# Altium schematic sheet 6_power_dcdc.SchDoc: Power management
size A4; OrganizationName: Pluton UPV; Address1: Universitat Politècnica; Address2: de València (UPV); Address3: Camí de Vera, València; Address4: Spain; SheetNumber: 11; SheetTotal: 12
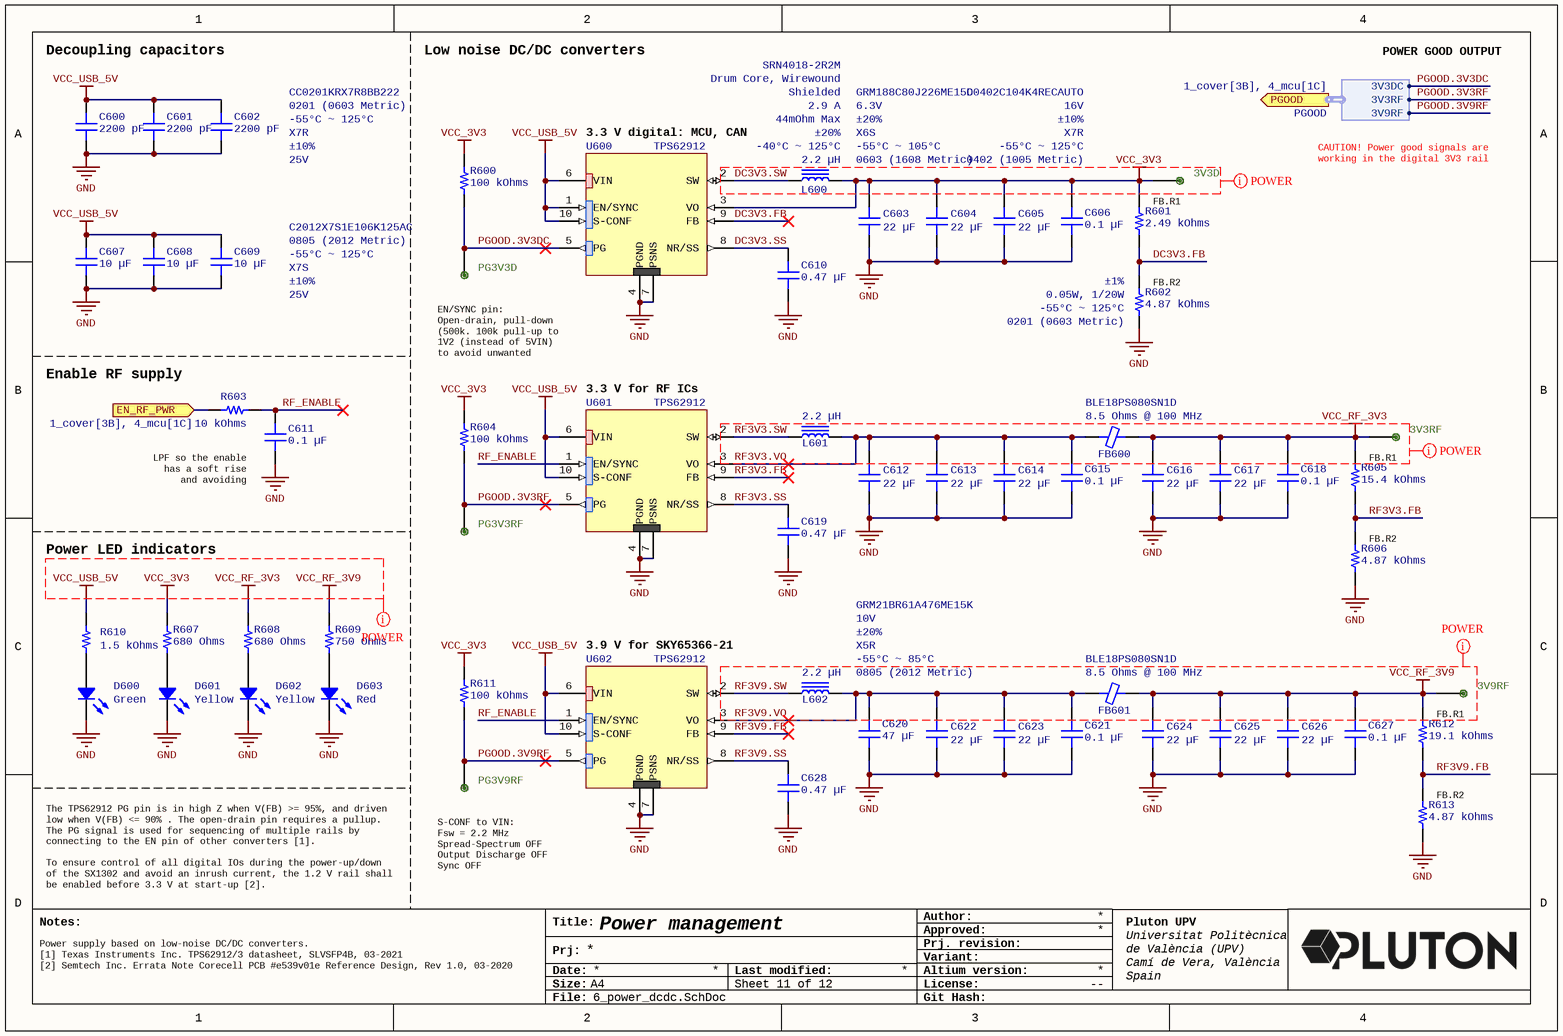
[diagram p0: 6_power_dcdc.SchDoc]

## Parts
3V3D  (no value)  [testpoint_via]  (no BOM)
3V3RF  (no value)  [testpoint_via]  (no BOM)
3V9RF  (no value)  [testpoint_via]  (no BOM)
C600  2200 pF  [CAP 0201_0603]
C601  2200 pF  [CAP 0201_0603]
C602  Part Number: CC0201KRX7R8BB222  Device Package: 0201 (0603 Metric)  Operating Temperature: -55°C ~ 125°C  Temperature Coefficient: X7R  Tolerance: ±10%  Voltage - Rated: 25V  [CAP 0201_0603]  (hidden comment: 2200 pF)
C603  Part Number: GRM188C80J226ME15D  Device Package: 0603 (1608 Metric)  Operating Temperature: -55°C ~ 105°C  Temperature Coefficient: X6S  Tolerance: ±20%  Voltage - Rated: 6.3V  [CAP 0603_1608]  (hidden comment: 22 µF)
C604  22 µF  [CAP 0603_1608]
C605  22 µF  [CAP 0603_1608]
C606  Part Number: C0402C104K4RECAUTO  Operating Temperature: -55°C ~ 125°C  Package / Case: 0402 (1005 Metric)  Temperature Coefficient: X7R  Tolerance: ±10%  Voltage - Rated: 16V  [CAP 0402_1005]  (hidden comment: 0.1 µF)
C607  10 µF  [CAP 0805_2012]
C608  10 µF  [CAP 0805_2012]
C609  Part Number: C2012X7S1E106K125AC  Device Package: 0805 (2012 Metric)  Operating Temperature: -55°C ~ 125°C  Temperature Coefficient: X7S  Tolerance: ±10%  Voltage - Rated: 25V  [CAP 0805_2012]  (hidden comment: 10 µF)
C610  0.47 µF  [CAP 0402_1005]
C611  0.1 µF  [CAP 0402_1005]
C612  22 µF  [CAP 0603_1608]
C613  22 µF  [CAP 0603_1608]
C614  22 µF  [CAP 0603_1608]
C615  0.1 µF  [CAP 0402_1005]
C616  22 µF  [CAP 0603_1608]
C617  22 µF  [CAP 0603_1608]
C618  0.1 µF  [CAP 0402_1005]
C619  0.47 µF  [CAP 0402_1005]
C620  Part Number: GRM21BR61A476ME15K  Device Package: 0805 (2012 Metric)  Operating Temperature: -55°C ~ 85°C  Temperature Coefficient: X5R  Tolerance: ±20%  Voltage - Rated: 10V  [CAP 0805_2012]  (hidden comment: 47 µF)
C621  0.1 µF  [CAP 0402_1005]
C622  22 µF  [CAP 0603_1608]
C623  22 µF  [CAP 0603_1608]
C624  22 µF  [CAP 0603_1608]
C625  22 µF  [CAP 0603_1608]
C626  22 µF  [CAP 0603_1608]
C627  0.1 µF  [CAP 0402_1005]
C628  0.47 µF  [CAP 0402_1005]
D600  Green  [LED 0402_1005 GREEN]
D601  Yellow  [LED 0402_1005 YELLOW]
D602  Yellow  [LED 0402_1005 YELLOW]
D603  Red  [LED 0402_1005 RED]
FB600  Part Number: BLE18PS080SN1D  [FER 0603_1608]  (hidden comment: 8.5 Ohms @ 100 MHz)
FB601  Part Number: BLE18PS080SN1D  [FER 0603_1608]  (hidden comment: 8.5 Ohms @ 100 MHz)
L600  2.2 µH  Part Number: SRN4018-2R2M  Current Rating (Amps): 2.9 A  DC Resistance (DCR): 44mOhm Max  Operating Temperature: -40°C ~ 125°C  Shielding: Shielded  Tolerance: ±20%  Type: Drum Core, Wirewound  [BOURNS SRN4018]
L601  2.2 µH  [BOURNS SRN4018]
L602  2.2 µH  [BOURNS SRN4018]
PG3V3D  (no value)  [testpoint_via]  (no BOM)
PG3V3RF  (no value)  [testpoint_via]  (no BOM)
PG3V9RF  (no value)  [testpoint_via]  (no BOM)
R600  100 kOhms  [RES 0201_0603]
R601  2.49 kOhms  [RES 0201_0603]
R602  Device Package: 0201 (0603 Metric)  Operating Temperature: -55°C ~ 125°C  Power (Watts): 0.05W, 1/20W  Tolerance: ±1%  [RES 0201_0603]  (hidden comment: 4.87 kOhms)
R603  10 kOhms  [RES 0201_0603]
R604  100 kOhms  [RES 0201_0603]
R605  15.4 kOhms  [RES 0201_0603]
R606  4.87 kOhms  [RES 0201_0603]
R607  680 Ohms  [RES 0201_0603]
R608  680 Ohms  [RES 0201_0603]
R609  750 Ohms  [RES 0201_0603]
R610  1.5 kOhms  [RES 0201_0603]
R611  100 kOhms  [RES 0201_0603]
R612  19.1 kOhms  [RES 0201_0603]
R613  4.87 kOhms  [RES 0201_0603]
U600  TPS62912  [VQFN-HR-TPS6291X]
U601  TPS62912  [VQFN-HR-TPS6291X]
U602  TPS62912  [VQFN-HR-TPS6291X]

## Ports
EN_RF_PWR (in, see 1_cover[3B], 4_mcu[1C]), PGOOD (out, harness PGOOD, see 1_cover[3B], 4_mcu[1C])

## Harnesses
PGOOD: 3V3DC, 3V3RF, 3V9RF

## Nets
GND: C600.1 C601.1 C602.1 C603.1 C604.1 C605.1 C606.1 C607.1 C608.1 C609.1 C610.1 C611.1 C612.1 C613.1 C614.1 C615.1 C616.1 C617.1 C618.1 C619.1 C620.1 C621.1 C622.1 C623.1 C624.1 C625.1 C626.1 C627.1 C628.1 D600.2 D601.2 D602.2 D603.2 R602.1 R606.1 R613.1 U600.4(PGND) U600.7(PSNS) U601.4(PGND) U601.7(PSNS) U602.4(PGND) U602.7(PSNS)
VCC_3V3: 3V3D.0 C603.2 C604.2 C605.2 C606.2 L600.2 R600.2 R601.2 R604.2 R607.2 R611.2 U600.3(VO)
VCC_RF_3V3: 3V3RF.0 C616.2 C617.2 C618.2 FB600.2 R605.2 R608.2
VCC_RF_3V9: 3V9RF.0 C624.2 C625.2 C626.2 C627.2 FB601.2 R609.2 R612.2
VCC_USB_5V: C600.2 C601.2 C602.2 C607.2 C608.2 C609.2 R610.2 U600.1(EN/SYNC) U600.6(VIN) U600.10(S-CONF) U601.6(VIN) U601.10(S-CONF) U602.6(VIN) U602.10(S-CONF)
DC3V3.FB: R601.1 R602.2 U600.9(FB)
DC3V3.SS: C610.2 U600.8(NR/SS)
DC3V3.SW: L600.1 U600.2(SW)
EN_RF_PWR: R603.2 ; port EN_RF_PWR
PGOOD.3V3DC: PG3V3D.0 R600.1 U600.5(PG) ; port PGOOD.3V3DC
PGOOD.3V3RF: PG3V3RF.0 R604.1 U601.5(PG) ; port PGOOD.3V3RF
PGOOD.3V9RF: PG3V9RF.0 R611.1 U602.5(PG) ; port PGOOD.3V9RF
RF3V3.FB: R605.1 R606.2 U601.9(FB)
RF3V3.SS: C619.2 U601.8(NR/SS)
RF3V3.SW: L601.1 U601.2(SW)
RF3V3.VO: C612.2 C613.2 C614.2 C615.2 FB600.1 L601.2 U601.3(VO)
RF3V9.FB: R612.1 R613.2 U602.9(FB)
RF3V9.SS: C628.2 U602.8(NR/SS)
RF3V9.SW: L602.1 U602.2(SW)
RF3V9.VO: C620.2 C621.2 C622.2 C623.2 FB601.1 L602.2 U602.3(VO)
RF_ENABLE: C611.2 R603.1 U601.1(EN/SYNC) U602.1(EN/SYNC)
NetD600_1: D600.1 R610.1
NetD601_1: D601.1 R607.1
NetD602_1: D602.1 R608.1
NetD603_1: D603.1 R609.1

## Layout directives
rule Width Constraint [Pref Width = 0.4mm    Min Width = 0.3mm    Max Width = 0.5mm]; net class POWER: DC3V3.SW, RF3V3.SW, RF3V3.VO, RF3V9.SW, RF3V9.VO, VCC_3V3, VCC_RF_3V3, VCC_RF_3V9, VCC_USB_5V

## Notes on the sheet
- Decoupling capacitors
- Low noise DC/DC converters
- POWER GOOD OUTPUT
- (near U600) 3.3 V digital: MCU, CAN
- CAUTION! Power good signals are working in the digital 3V3 rail
- FB.R1
- (near R602) FB.R2
- Enable RF supply
- EN/SYNC pin: Open-drain, pull-down (500k. 100k pull-up to 1V2 (instead of 5VIN) to avoid unwanted power-up
- (near U601) 3.3 V for RF ICs
- LPF so the enable
  has a soft rise
  and avoiding glitches
- Power LED indicators
- (near R606) FB.R2
- (near U602) 3.9 V for SKY65366-21
- The TPS62912 PG pin is in high Z when V(FB) >= 95%, and driven low when V(FB) <= 90% . The open-drain pin requires a pullup. The PG signal is used for sequencing of multiple rails by connecting to the EN pin of other converters [1].
- (near R613) FB.R2
- To ensure control of all digital IOs during the power-up/down of the SX1302 and avoid an inrush current, the 1.2 V rail shall be enabled before 3.3 V at start-up [2].
- S-CONF to VIN:
  Fsw = 2.2 MHz
  Spread-Spectrum OFF
  Output Discharge OFF
  Sync OFF
- Power supply based on low-noise DC/DC converters.
  [1] Texas Instruments Inc. TPS62912/3 datasheet, SLVSFP4B, 03-2021
  [2] Semtech Inc. Errata Note Corecell PCB #e539v01e Reference Design, Rev 1.0, 03-2020
- Notes:
- Title:
- Author:
- Approved:
- Date:
- Prj:
- Size:
- A4
- Last modified:
- Altium version:
- Variant:
- Prj. revision:
- License:
- --
- File:
- Git Hash:

## Library data of the parts
3V3D 3V3RF 3V9RF PG3V3D PG3V3RF PG3V9RF = TestPoint-VIA: Test point, thru-hole
C600 C601 = CC0201KRX7R8BB222: CAP CER 2200PF 25V X7R 0201; manufacturer: Yageo; Tolerance: ±10%; Part Number: CC0201KRX7R8BB222; Value: 2200 pF; Applications: General Purpose; Capacitance: 2200 pF; componentlink1description: Datasheet; componentlink1url: https://www.yageo.com/upload/media/product/productsearch/datasheet/mlcc/UPY-GPHC_X7R_6.3V-to-250V_22.pdf; componentlink2description: DigiKey Link; componentlink2url: https://www.digikey.com/en/products/detail/yageo/CC0201KRX7R8BB222/11490225; Device Package: 0201 (0603 Metric); lastupdated: 04/06/2024 19:00:56; Lifecycle Status: Active; Minimum Order: 1; Mounting Type: Surface Mount, MLCC; Operating Temperature: -55°C ~ 125°C; Package / Case: 0201 (0603 Metric); packaging: CutTape; partid: 52408; Part Status: Active; price: 0.01; series: CC; Size / Dimension: 0.024" L x 0.012" W (0.60mm x 0.30mm); Supplier 1: DigiKey; Supplier Part Number 1: 13-CC0201KRX7R8BB222CT-ND; Temperature Coefficient: X7R; Thickness (Max): 0.013" (0.33mm); Voltage - Rated: 25V
C602 = CC0201KRX7R8BB222: CAP CER 2200PF 25V X7R 0201; manufacturer: Yageo; Value: 2200 pF; Applications: General Purpose; Capacitance: 2200 pF; componentlink1description: Datasheet; componentlink1url: https://www.yageo.com/upload/media/product/productsearch/datasheet/mlcc/UPY-GPHC_X7R_6.3V-to-250V_22.pdf; componentlink2description: DigiKey Link; componentlink2url: https://www.digikey.com/en/products/detail/yageo/CC0201KRX7R8BB222/11490225; lastupdated: 04/06/2024 19:00:56; Lifecycle Status: Active; Minimum Order: 1; Mounting Type: Surface Mount, MLCC; Package / Case: 0201 (0603 Metric); packaging: CutTape; partid: 52408; Part Status: Active; price: 0.01; series: CC; Size / Dimension: 0.024" L x 0.012" W (0.60mm x 0.30mm); Supplier 1: DigiKey; Supplier Part Number 1: 13-CC0201KRX7R8BB222CT-ND; Thickness (Max): 0.013" (0.33mm)
C603 = GRM188C80J226ME15D: CAP CER 22UF 6.3V X6S 0603; manufacturer: Murata Electronics; Value: 22 µF; Applications: General Purpose; Capacitance: 22 µF; componentlink1description: Datasheet; componentlink1url: https://search.murata.co.jp/Ceramy/image/img/A01X/G101/ENG/GRM188C80J226ME15-01.pdf; componentlink2description: DigiKey Link; componentlink2url: https://www.digikey.com/en/products/detail/murata-electronics/GRM188C80J226ME15D/5027556; lastupdated: 09/02/2024 20:10:26; Lifecycle Status: Active; Minimum Order: 1; Mounting Type: Surface Mount, MLCC; Package / Case: 0603 (1608 Metric); packaging: TapeAndReel; partid: 39580; Part Status: Active; price: 0.03; series: GRM; Size / Dimension: 0.063" L x 0.031" W (1.60mm x 0.80mm); Supplier 1: DigiKey; Supplier Part Number 1: 490-10471-1-ND; Thickness (Max): 0.039" (1.00mm)
C604 C605 C612-C614 C616 C617 C622-C626 = GRM188C80J226ME15D: CAP CER 22UF 6.3V X6S 0603; manufacturer: Murata Electronics; Tolerance: ±20%; Part Number: GRM188C80J226ME15D; Value: 22 µF; Applications: General Purpose; Capacitance: 22 µF; componentlink1description: Datasheet; componentlink1url: https://search.murata.co.jp/Ceramy/image/img/A01X/G101/ENG/GRM188C80J226ME15-01.pdf; componentlink2description: DigiKey Link; componentlink2url: https://www.digikey.com/en/products/detail/murata-electronics/GRM188C80J226ME15D/5027556; Device Package: 0603 (1608 Metric); lastupdated: 09/02/2024 20:10:26; Lifecycle Status: Active; Minimum Order: 1; Mounting Type: Surface Mount, MLCC; Operating Temperature: -55°C ~ 105°C; Package / Case: 0603 (1608 Metric); packaging: TapeAndReel; partid: 39580; Part Status: Active; price: 0.03; series: GRM; Size / Dimension: 0.063" L x 0.031" W (1.60mm x 0.80mm); Supplier 1: DigiKey; Supplier Part Number 1: 490-10471-1-ND; Temperature Coefficient: X6S; Thickness (Max): 0.039" (1.00mm); Voltage - Rated: 6.3V
C606 C611 C615 C618 C621 C627 = C0402C104K4RECAUTO: CAP CER 0402 0.1UF 16V X7R 10%; manufacturer: KEMET; Value: 0.1 µF; Applications: Automotive, ESD Protection; Capacitance: 0.1 µF; componentlink1description: Datasheet; componentlink1url: https://api.kemet.com/component-edge/download/datasheet/C0402C104K4RECAUTO.pdf; componentlink2description: DigiKey Link; componentlink2url: https://www.digikey.com/en/products/detail/kemet/C0402C104K4RECAUTO/8563695; Device Package: 0402 (1005 Metric); lastupdated: 09/02/2024 20:04:38; Lifecycle Status: Active; Minimum Order: 1; Mounting Type: Surface Mount, MLCC; packaging: TapeAndReel; partid: 1731; Part Status: Active; price: 0.01; Ratings: AEC-Q200; series: ESD SMD Auto X7R; Size / Dimension: 0.039" L x 0.020" W (1.00mm x 0.50mm); Supplier 1: DigiKey; Supplier Part Number 1: 399-17167-1-ND; Thickness (Max): 0.022" (0.55mm)
  C611 C615 C618 C621 C627: Part Number: C0402C104K4RECAUTO; Operating Temperature: -55°C ~ 125°C; Package / Case: 0402 (1005 Metric); Temperature Coefficient: X7R; Tolerance: ±10%; Voltage - Rated: 16V
C607 C608 = C2012X7S1E106K125AC: CAP CER 10UF 25V X7S 0805; manufacturer: TDK Corporation; Tolerance: ±10%; Part Number: C2012X7S1E106K125AC; Value: 10 µF; Applications: General Purpose; Capacitance: 10 µF; componentlink1description: Datasheet; componentlink1url: https://product.tdk.com/en/search/capacitor/ceramic/mlcc/info?part_no=C2012X7S1E106K125AC?ref_disty=digikey; componentlink2description: DigiKey Link; componentlink2url: https://www.digikey.com/en/products/detail/tdk-corporation/C2012X7S1E106K125AC/9991385; Device Package: 0805 (2012 Metric); Features: Low ESL; lastupdated: 09/02/2024 20:16:06; Lifecycle Status: Active; Minimum Order: 1; Mounting Type: Surface Mount, MLCC; Operating Temperature: -55°C ~ 125°C; Package / Case: 0805 (2012 Metric); packaging: TapeAndReel; partid: 39303; Part Status: Active; price: 0.11; series: C; Size / Dimension: 0.079" L x 0.049" W (2.00mm x 1.25mm); Supplier 1: DigiKey; Supplier Part Number 1: 445-181600-1-ND; Temperature Coefficient: X7S; Thickness (Max): 0.059" (1.50mm); Voltage - Rated: 25V
C609 = C2012X7S1E106K125AC: CAP CER 10UF 25V X7S 0805; manufacturer: TDK Corporation; Value: 10 µF; Applications: General Purpose; Capacitance: 10 µF; componentlink1description: Datasheet; componentlink1url: https://product.tdk.com/en/search/capacitor/ceramic/mlcc/info?part_no=C2012X7S1E106K125AC?ref_disty=digikey; componentlink2description: DigiKey Link; componentlink2url: https://www.digikey.com/en/products/detail/tdk-corporation/C2012X7S1E106K125AC/9991385; Features: Low ESL; lastupdated: 09/02/2024 20:16:06; Lifecycle Status: Active; Minimum Order: 1; Mounting Type: Surface Mount, MLCC; Package / Case: 0805 (2012 Metric); packaging: TapeAndReel; partid: 39303; Part Status: Active; price: 0.11; series: C; Size / Dimension: 0.079" L x 0.049" W (2.00mm x 1.25mm); Supplier 1: DigiKey; Supplier Part Number 1: 445-181600-1-ND; Thickness (Max): 0.059" (1.50mm)
C610 C619 C628 = CGA2B1X7S1C474K050BC: CAP CER 0.47UF 16V X7S 0402; manufacturer: TDK Corporation; Tolerance: ±10%; Part Number: CGA2B1X7S1C474K050BC; Value: 0.47 µF; Applications: Automotive; Capacitance: 0.47 µF; componentlink1description: Datasheet; componentlink1url: https://product.tdk.com/info/en/catalog/datasheets/mlcc_automotive_general_en.pdf?ref_disty=digikey; componentlink2description: DigiKey Link; componentlink2url: https://www.digikey.com/en/products/detail/tdk-corporation/CGA2B1X7S1C474K050BC/4931442; Device Package: 0402 (1005 Metric); lastupdated: 09/02/2024 20:04:28; Lifecycle Status: Active; Minimum Order: 1; Mounting Type: Surface Mount, MLCC; Operating Temperature: -55°C ~ 125°C; Package / Case: 0402 (1005 Metric); packaging: TapeAndReel; partid: 7602; Part Status: Active; price: 0.03; Ratings: AEC-Q200; series: CGA; Size / Dimension: 0.039" L x 0.020" W (1.00mm x 0.50mm); Supplier 1: DigiKey; Supplier Part Number 1: 445-174214-1-ND; Temperature Coefficient: X7S; Thickness (Max): 0.022" (0.55mm); Voltage - Rated: 16V
C620 = GRM21BR61A476ME15K: CAP CER 47UF 10V X5R 0805; manufacturer: Murata Electronics; Value: 47 µF; Applications: General Purpose; Capacitance: 47 µF; componentlink1description: Datasheet; componentlink1url: https://www.murata.com/-/media/webrenewal/support/library/catalog/products/capacitor/ceramiccapacitor/c02e.ashx?la=en-us&cvid=20210120024548000000; componentlink2description: DigiKey Link; componentlink2url: https://www.digikey.com/en/products/detail/murata-electronics/GRM21BR61A476ME15K/4905528; lastupdated: 09/02/2024 20:14:59; Lifecycle Status: Active; Minimum Order: 1; Mounting Type: Surface Mount, MLCC; Package / Case: 0805 (2012 Metric); packaging: TapeAndReel; partid: 44285; Part Status: Active; price: 0.13; series: GRM; Size / Dimension: 0.079" L x 0.049" W (2.00mm x 1.25mm); Supplier 1: DigiKey; Supplier Part Number 1: 490-GRM21BR61A476ME15KCT-ND; Thickness (Max): 0.057" (1.45mm)
D600 = EAST10052GA0: LED GREEN CLEAR 2SMD; Manufacturer: Everlight Electronics Co Ltd; Configuration: Standard; Current - Test: 5mA; Lens Color: Colorless; Lens Size: 1.00mm x 0.50mm; Lens Style: Rectangle with Flat Top; Viewing Angle: 120°; Voltage - Forward (Vf) (Typ): 2.95V; Wavelength - Peak: 518nm; Part Number: EAST10052GA0; Color: Green; ComponentLink1Description: Datasheet; ComponentLink1URL: https://everlightamericas.com/index.php?controller=attachment&id_attachment=3256; ComponentLink2Description: DigiKey Link; ComponentLink2URL: https://www.digikey.com/en/products/detail/everlight-electronics-co-ltd/EAST10052GA0/8510366; Device Package: 0402 (1005 Metric); Height (Max): 0.25mm; LastUpdated: 03/06/2024 19:58:14; Lens Transparency: Clear; Lifecycle Status: Active; Minimum Order: 1; Mounting Type: Surface Mount; Package / Case: 0402 (1005 Metric); Packaging: TapeAndReel; PartId: 696; Part Status: Active; Price: 0.09; Series: -; Size / Dimension: 1.00mm L x 0.50mm W; Supplier 1: DigiKey; Supplier Part Number 1: 1080-1557-1-ND; Supplier Device Package: 2-SMD; Value: Green
D601 D602 = FHY1105P-TR: LED YELLOW CLEAR 1005 SMD; Manufacturer: Stanley Electric Co; Configuration: Standard; Current - Test: 5mA; Lens Color: Colorless; Lens Size: 1.00mm x 0.50mm; Lens Style: Rectangle with Flat Top; Millicandela Rating: 32mcd; Voltage - Forward (Vf) (Typ): 1.9V; Wavelength - Dominant: 590nm; Wavelength - Peak: 594nm; Part Number: FHY1105P-TR; Color: Yellow; ComponentLink1Description: Datasheet; ComponentLink1URL: http://www.stanley-components.com/php/downloaddatafile.php?rp=0,FHY1105P-TR_e.pdf; ComponentLink2Description: DigiKey Link; ComponentLink2URL: https://www.digikey.com/en/products/detail/stanley-electric-co/FHY1105P-TR/6205303; Device Package: 0402 (1005 Metric); Height (Max): 0.25mm; LastUpdated: 03/06/2024 20:00:47; Lens Transparency: Clear; Lifecycle Status: Active; Minimum Order: 1; Mounting Type: Surface Mount; Package / Case: 0402 (1005 Metric); Packaging: TapeAndReel; PartId: 166; Part Status: Active; Price: 0.05; Series: -; Size / Dimension: 1.00mm L x 0.50mm W; Supplier 1: DigiKey; Supplier Part Number 1: 404-1209-1-ND; Supplier Device Package: 1005; Value: Yellow
D603 = EAST10053RA0: LED RED CLEAR 2SMD; Manufacturer: Everlight Electronics Co Ltd; Configuration: Standard; Current - Test: 5mA; Lens Color: Colorless; Lens Size: 1.00mm x 0.50mm; Lens Style: Rectangle with Flat Top; Viewing Angle: 120°; Voltage - Forward (Vf) (Typ): 2.05V; Wavelength - Peak: 639nm; Part Number: EAST10053RA0; Color: Red; ComponentLink1Description: Datasheet; ComponentLink1URL: https://everlightamericas.com/index.php?controller=attachment&id_attachment=3575; ComponentLink2Description: DigiKey Link; ComponentLink2URL: https://www.digikey.com/en/products/detail/everlight-electronics-co-ltd/EAST10053RA0/8510365; Device Package: 0402 (1005 Metric); Height (Max): 0.35mm; LastUpdated: 03/06/2024 19:59:17; Lens Transparency: Clear; Lifecycle Status: Active; Minimum Order: 1; Mounting Type: Surface Mount; Package / Case: 0402 (1005 Metric); Packaging: TapeAndReel; PartId: 508; Part Status: Active; Price: 0.05; Series: -; Size / Dimension: 1.00mm L x 0.50mm W; Supplier 1: DigiKey; Supplier Part Number 1: 1080-1556-1-ND; Supplier Device Package: 2-SMD; Value: Red
FB600 FB601 = BLE18PS080SN1D: FERRITE BEAD 8.5 OHM 0603 1LN; Manufacturer: Murata Electronics; Current Rating (Max): 8A; DC Resistance (DCR) (Max): 4mOhm; Filter Type: Power Line; Number of Lines: 1; ComponentLink1Description: Datasheet; ComponentLink1URL: https://www.murata.com/products/productdata/8800169525278/ENFA0080.pdf; ComponentLink2Description: DigiKey Link; ComponentLink2URL: https://www.digikey.com/en/products/detail/murata-electronics/BLE18PS080SN1D/13904803; Device Package: 0603 (1608 Metric); Height (Max): 0.030" (0.75mm); Impedance @ Frequency: 8.5 Ohms @ 100 MHz; LastUpdated: 03/06/2024 19:51:46; Lifecycle Status: Active; Minimum Order: 1; Mounting Type: Surface Mount; Operating Temperature: -55°C ~ 125°C; Package / Case: 0603 (1608 Metric); Packaging: TapeAndReel; PartId: 2651; Part Status: Active; Price: 0.08; Series: EMIFIL®, BLE18; Size / Dimension: 0.063" L x 0.031" W (1.60mm x 0.80mm); Supplier 1: DigiKey; Supplier Part Number 1: 490-BLE18PS080SN1DCT-ND; Value: 8.5 Ohms @ 100 MHz
L600 = SRN4018-2R2M: FIXED IND 2.2UH 2.9A 44 MOHM SMD; Manufacturer: Bourns Inc.; Current - Saturation: 3A; Frequency - Self Resonant: 60MHz; Inductance Frequency - Test: 100 kHz; Material - Core: Ferrite; Q @ Freq: 9 @ 7.96MHz; ComponentLink1Description: Datasheet; ComponentLink1URL: https://www.bourns.com/docs/Product-Datasheets/SRN4018.pdf; ComponentLink2Description: DigiKey Link; ComponentLink2URL: https://www.digikey.com/en/products/detail/bourns-inc/SRN4018-2R2M/3821619; Device Package: Nonstandard; Height - Seated (Max): 0.071" (1.80mm); Inductance: 2.2 µH; LastUpdated: 03/06/2024 20:24:37; Lifecycle Status: Active; Minimum Order: 1; Mounting Type: Surface Mount; Package / Case: Nonstandard; Packaging: TapeAndReel; PartId: 3660; Part Status: Active; Price: 0.17; Series: SRN4018; Size / Dimension: 0.157" L x 0.157" W (4.00mm x 4.00mm); Supplier 1: DigiKey; Supplier Part Number 1: SRN4018-2R2MCT-ND; Value: 2.2 µH
L601 L602 = SRN4018-2R2M: FIXED IND 2.2UH 2.9A 44 MOHM SMD; Manufacturer: Bourns Inc.; Current - Saturation: 3A; DC Resistance (DCR): 44mOhm Max; Frequency - Self Resonant: 60MHz; Inductance Frequency - Test: 100 kHz; Material - Core: Ferrite; Q @ Freq: 9 @ 7.96MHz; Shielding: Shielded; Tolerance: ±20%; Type: Drum Core, Wirewound; Part Number: SRN4018-2R2M; ComponentLink1Description: Datasheet; ComponentLink1URL: https://www.bourns.com/docs/Product-Datasheets/SRN4018.pdf; ComponentLink2Description: DigiKey Link; ComponentLink2URL: https://www.digikey.com/en/products/detail/bourns-inc/SRN4018-2R2M/3821619; Current Rating (Amps): 2.9 A; Device Package: Nonstandard; Height - Seated (Max): 0.071" (1.80mm); Inductance: 2.2 µH; LastUpdated: 03/06/2024 20:24:37; Lifecycle Status: Active; Minimum Order: 1; Mounting Type: Surface Mount; Operating Temperature: -40°C ~ 125°C; Package / Case: Nonstandard; Packaging: TapeAndReel; PartId: 3660; Part Status: Active; Price: 0.17; Series: SRN4018; Size / Dimension: 0.157" L x 0.157" W (4.00mm x 4.00mm); Supplier 1: DigiKey; Supplier Part Number 1: SRN4018-2R2MCT-ND; Value: 2.2 µH
R600 R604 R611 = RC0201FR-13100KL: RES 100K OHM 1% 1/20W 0201; Manufacturer: Yageo; Power (Watts): 0.05W, 1/20W; Temperature Coefficient: ±200ppm/°C; Part Number: RC0201FR-13100KL; Value: 100 kOhms; ComponentLink1Description: Datasheet; ComponentLink1URL: https://www.yageo.com/upload/media/product/productsearch/datasheet/rchip/PYu-RC_Group_51_RoHS_L_12.pdf; ComponentLink2Description: DigiKey Link; ComponentLink2URL: https://www.digikey.com/en/products/detail/yageo/RC0201FR-13100KL/17014509; Composition: Thick Film; Device Package: 0201 (0603 Metric); Features: Moisture Resistant; Height - Seated (Max): 0.010" (0.26mm); LastUpdated: 04/06/2024 19:11:47; Lifecycle Status: Active; Minimum Order: 1; Number of Terminations: 2; Operating Temperature: -55°C ~ 125°C; Package / Case: 0201 (0603 Metric); Packaging: CutTape; PartId: 80199; Price: 0.01; Resistance: 100 kOhms; Series: RC_L; Size / Dimension: 0.024" L x 0.012" W (0.60mm x 0.30mm); Supplier 1: DigiKey; Supplier Part Number 1: 13-RC0201FR-13100KLCT-ND; Supplier Device Package: 0201; Tolerance: ±1%
R601 = AC0201FR-072K49L: RES SMD 2.49K OHM 1% 1/20W 0201; Manufacturer: Yageo; Power (Watts): 0.05W, 1/20W; Temperature Coefficient: ±200ppm/°C; Part Number: AC0201FR-072K49L; Value: 2.49 kOhms; ComponentLink1Description: Datasheet; ComponentLink1URL: https://www.yageo.com/upload/media/product/productsearch/datasheet/rchip/PYu-AC_51_RoHS_L_7.pdf; ComponentLink2Description: DigiKey Link; ComponentLink2URL: https://www.digikey.com/en/products/detail/yageo/AC0201FR-072K49L/5894499; Composition: Thick Film; Device Package: 0201 (0603 Metric); Features: Automotive AEC-Q200, Moisture Resistant; Height - Seated (Max): 0.010" (0.26mm); LastUpdated: 04/06/2024 19:11:59; Lifecycle Status: Active; Minimum Order: 1; Number of Terminations: 2; Operating Temperature: -55°C ~ 155°C; Package / Case: 0201 (0603 Metric); Packaging: TapeAndReel; PartId: 986; Part Status: Active; Price: 0.01; Ratings: AEC-Q200; Resistance: 2.49 kOhms; Series: AC; Size / Dimension: 0.024" L x 0.012" W (0.60mm x 0.30mm); Supplier 1: DigiKey; Supplier Part Number 1: YAG5189CT-ND; Supplier Device Package: 0201; Tolerance: ±1%
R602 = RC0201FR-074K87L: RES 4.87K OHM 1% 1/20W 0201; Manufacturer: Yageo; Temperature Coefficient: ±200ppm/°C; Part Number: RC0201FR-074K87L; Value: 4.87 kOhms; ComponentLink1Description: Datasheet; ComponentLink1URL: https://www.yageo.com/upload/media/product/productsearch/datasheet/rchip/PYu-RC_Group_51_RoHS_L_10.pdf; ComponentLink2Description: DigiKey Link; ComponentLink2URL: https://www.digikey.com/en/products/detail/yageo/RC0201FR-074K87L/5280571; Composition: Thick Film; Features: Moisture Resistant; Height - Seated (Max): 0.010" (0.26mm); LastUpdated: 04/06/2024 19:11:58; Lifecycle Status: Active; Minimum Order: 1; Number of Terminations: 2; Package / Case: 0201 (0603 Metric); Packaging: TapeAndReel; PartId: 1350; Part Status: Active; Price: 0.01; Resistance: 4.87 kOhms; Series: RC_L; Size / Dimension: 0.024" L x 0.012" W (0.60mm x 0.30mm); Supplier 1: DigiKey; Supplier Part Number 1: YAG2711CT-ND; Supplier Device Package: 0201
R603 = AF0201FR-0710KL: RES SMD 10K OHM 1% 1/20W 0201; Manufacturer: Yageo; Power (Watts): 0.05W, 1/20W; Temperature Coefficient: ±200ppm/°C; Part Number: AF0201FR-0710KL; Value: 10 kOhms; ComponentLink1Description: Datasheet; ComponentLink1URL: https://www.yageo.com/upload/media/product/productsearch/datasheet/rchip/PYu-AF_51_RoHS_L_9.pdf; ComponentLink2Description: DigiKey Link; ComponentLink2URL: https://www.digikey.com/en/products/detail/yageo/AF0201FR-0710KL/5900138; Composition: Thick Film; Device Package: 0201 (0603 Metric); Features: Anti-Sulfur, Automotive AEC-Q200; Height - Seated (Max): 0.010" (0.26mm); LastUpdated: 04/06/2024 19:11:47; Lifecycle Status: Active; Minimum Order: 1; Number of Terminations: 2; Operating Temperature: -55°C ~ 125°C; Package / Case: 0201 (0603 Metric); Packaging: TapeAndReel; PartId: 78061; Part Status: Active; Price: 0.01; Ratings: AEC-Q200; Resistance: 10 kOhms; Series: AF; Size / Dimension: 0.024" L x 0.012" W (0.60mm x 0.30mm); Supplier 1: DigiKey; Supplier Part Number 1: 13-AF0201FR-0710KLCT-ND; Supplier Device Package: 0201; Tolerance: ±1%
R605 = RC0201FR-0715K4L: RES 15.4K OHM 1% 1/20W 0201; Manufacturer: Yageo; Power (Watts): 0.05W, 1/20W; Temperature Coefficient: ±200ppm/°C; Part Number: RC0201FR-0715K4L; Value: 15.4 kOhms; ComponentLink1Description: Datasheet; ComponentLink1URL: https://www.yageo.com/upload/media/product/productsearch/datasheet/rchip/PYu-RC_Group_51_RoHS_L_10.pdf; ComponentLink2Description: DigiKey Link; ComponentLink2URL: https://www.digikey.com/en/products/detail/yageo/RC0201FR-0715K4L/5280281; Composition: Thick Film; Device Package: 0201 (0603 Metric); Features: Moisture Resistant; Height - Seated (Max): 0.010" (0.26mm); LastUpdated: 04/06/2024 19:12:00; Lifecycle Status: Active; Minimum Order: 1; Number of Terminations: 2; Operating Temperature: -55°C ~ 125°C; Package / Case: 0201 (0603 Metric); Packaging: TapeAndReel; PartId: 714; Part Status: Active; Price: 0.01; Resistance: 15.4 kOhms; Series: RC_L; Size / Dimension: 0.024" L x 0.012" W (0.60mm x 0.30mm); Supplier 1: DigiKey; Supplier Part Number 1: YAG2421CT-ND; Supplier Device Package: 0201; Tolerance: ±1%
R606 R613 = RC0201FR-074K87L: RES 4.87K OHM 1% 1/20W 0201; Manufacturer: Yageo; Power (Watts): 0.05W, 1/20W; Temperature Coefficient: ±200ppm/°C; Part Number: RC0201FR-074K87L; Value: 4.87 kOhms; ComponentLink1Description: Datasheet; ComponentLink1URL: https://www.yageo.com/upload/media/product/productsearch/datasheet/rchip/PYu-RC_Group_51_RoHS_L_10.pdf; ComponentLink2Description: DigiKey Link; ComponentLink2URL: https://www.digikey.com/en/products/detail/yageo/RC0201FR-074K87L/5280571; Composition: Thick Film; Device Package: 0201 (0603 Metric); Features: Moisture Resistant; Height - Seated (Max): 0.010" (0.26mm); LastUpdated: 04/06/2024 19:11:58; Lifecycle Status: Active; Minimum Order: 1; Number of Terminations: 2; Operating Temperature: -55°C ~ 125°C; Package / Case: 0201 (0603 Metric); Packaging: TapeAndReel; PartId: 1350; Part Status: Active; Price: 0.01; Resistance: 4.87 kOhms; Series: RC_L; Size / Dimension: 0.024" L x 0.012" W (0.60mm x 0.30mm); Supplier 1: DigiKey; Supplier Part Number 1: YAG2711CT-ND; Supplier Device Package: 0201; Tolerance: ±1%
R607 R608 = RC0201JR-07680RL: RES 680 OHM 5% 1/20W 0201; Manufacturer: Yageo; Power (Watts): 0.05W, 1/20W; Temperature Coefficient: ±200ppm/°C; Part Number: RC0201JR-07680RL; Value: 680 Ohms; ComponentLink1Description: Datasheet; ComponentLink1URL: https://www.yageo.com/upload/media/product/productsearch/datasheet/rchip/PYu-RC_Group_51_RoHS_L_10.pdf; ComponentLink2Description: DigiKey Link; ComponentLink2URL: https://www.digikey.com/en/products/detail/yageo/RC0201JR-07680RL/1948962; Composition: Thick Film; Device Package: 0201 (0603 Metric); Features: Moisture Resistant; Height - Seated (Max): 0.010" (0.26mm); LastUpdated: 04/06/2024 19:12:00; Lifecycle Status: Active; Minimum Order: 1; Number of Terminations: 2; Operating Temperature: -55°C ~ 125°C; Package / Case: 0201 (0603 Metric); Packaging: CutTape; PartId: 715; Part Status: Active; Price: 0.01; Resistance: 680 Ohms; Series: RC_L; Size / Dimension: 0.024" L x 0.012" W (0.60mm x 0.30mm); Supplier 1: DigiKey; Supplier Part Number 1: 311-680NCT-ND; Supplier Device Package: 0201; Tolerance: ±5%
R609 = RC0201JR-07750RL: RES 750 OHM 5% 1/20W 0201; Manufacturer: Yageo; Power (Watts): 0.05W, 1/20W; Temperature Coefficient: ±200ppm/°C; Part Number: RC0201JR-07750RL; Value: 750 Ohms; ComponentLink1Description: Datasheet; ComponentLink1URL: https://www.yageo.com/upload/media/product/productsearch/datasheet/rchip/PYu-RC_Group_51_RoHS_L_10.pdf; ComponentLink2Description: DigiKey Link; ComponentLink2URL: https://www.digikey.com/en/products/detail/yageo/RC0201JR-07750RL/5280787; Composition: Thick Film; Device Package: 0201 (0603 Metric); Features: Moisture Resistant; Height - Seated (Max): 0.010" (0.26mm); LastUpdated: 04/06/2024 19:11:57; Lifecycle Status: Active; Minimum Order: 1; Number of Terminations: 2; Operating Temperature: -55°C ~ 125°C; Package / Case: 0201 (0603 Metric); Packaging: CutTape; PartId: 1858; Part Status: Active; Price: 0.01; Resistance: 750 Ohms; Series: RC_L; Size / Dimension: 0.024" L x 0.012" W (0.60mm x 0.30mm); Supplier 1: DigiKey; Supplier Part Number 1: YAG2927CT-ND; Supplier Device Package: 0201; Tolerance: ±5%
R610 = CRCW02011K50JNED: RES SMD 1.5K OHM 5% 1/20W 0201; Manufacturer: Vishay Dale; Power (Watts): 0.05W, 1/20W; Temperature Coefficient: ±200ppm/°C; Part Number: CRCW02011K50JNED; Value: 1.5 kOhms; ComponentLink1Description: Datasheet; ComponentLink1URL: http://www.vishay.com/docs/20052/crcw0201e3.pdf; ComponentLink2Description: DigiKey Link; ComponentLink2URL: http://digikey.com/product-detail/en/vishay-dale/CRCW02011K50JNED/541-CRCW02011K50JNEDCT-ND/10449419; Composition: Thick Film; Device Package: 0201 (0603 Metric); Height - Seated (Max): 0.011" (0.28mm); LastUpdated: 04/06/2024 19:12:01; Lifecycle Status: Active; Minimum Order: 1; Number of Terminations: 2; Operating Temperature: -55°C ~ 155°C; Package / Case: 0201 (0603 Metric); Packaging: CutTape; PartId: 491; Part Status: Active; Price: 0.10; Resistance: 1.5 kOhms; Series: CRCW; Size / Dimension: 0.024" L x 0.012" W (0.60mm x 0.30mm); Supplier 1: DigiKey; Supplier Part Number 1: 541-CRCW02011K50JNEDCT-ND; Supplier Device Package: 0201; Tolerance: ±5%
R612 = RC0201FR-0719K1L: RES 19.1K OHM 1% 1/20W 0201; Manufacturer: Yageo; Power (Watts): 0.05W, 1/20W; Temperature Coefficient: ±200ppm/°C; Part Number: RC0201FR-0719K1L; Value: 19.1 kOhms; ComponentLink1Description: Datasheet; ComponentLink1URL: https://www.yageo.com/upload/media/product/productsearch/datasheet/rchip/PYu-RC_Group_51_RoHS_L_10.pdf; ComponentLink2Description: DigiKey Link; ComponentLink2URL: https://www.digikey.com/en/products/detail/yageo/RC0201FR-0719K1L/5280324; Composition: Thick Film; Device Package: 0201 (0603 Metric); Features: Moisture Resistant; Height - Seated (Max): 0.010" (0.26mm); LastUpdated: 04/06/2024 19:11:59; Lifecycle Status: Active; Minimum Order: 1; Number of Terminations: 2; Operating Temperature: -55°C ~ 125°C; Package / Case: 0201 (0603 Metric); Packaging: TapeAndReel; PartId: 1027; Part Status: Active; Price: 0.01; Resistance: 19.1 kOhms; Series: RC_L; Size / Dimension: 0.024" L x 0.012" W (0.60mm x 0.30mm); Supplier 1: DigiKey; Supplier Part Number 1: YAG2464CT-ND; Supplier Device Package: 0201; Tolerance: ±1%
U600-U602 = TPS62912: 3-V to 17-V, 2-A/3-A Low Noise and Low Ripple Buck Converter with Integrated Ferrite Bead Filter Compensation